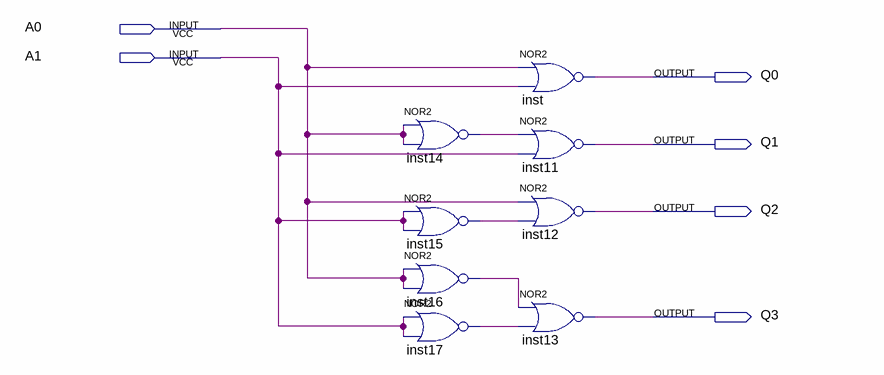
[diagram p0: schematic sheet]
// Quartus schematic DC_2input_2nor.bdf as structural Verilog: 8 symbols, 6 pins
module DC_2input_2nor (
  input  A0,
  input  A1,
  output Q0,
  output Q1,
  output Q2,
  output Q3
);

  wire inst14_out, inst15_out, inst16_out, inst17_out;

  nor inst14 (inst14_out, A0, A0);
  nor inst15 (inst15_out, A1, A1);
  nor inst16 (inst16_out, A0, A0);
  nor inst17 (inst17_out, A1, A1);
  nor inst (Q0, A0, A1);
  nor inst11 (Q1, inst14_out, A1);
  nor inst12 (Q2, A0, inst15_out);
  nor inst13 (Q3, inst16_out, inst17_out);
endmodule
